# Altium schematic sheet XBee.SchDoc
size A
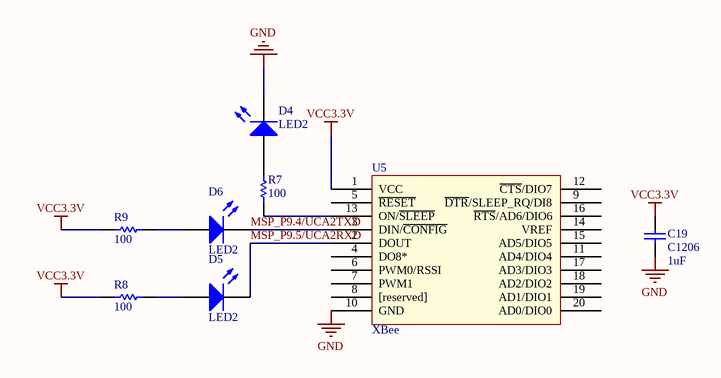
[diagram p0: XBee.SchDoc]

## Parts
C19  C1206  value 1uF  [1206]
D4  LED2  [LED_LiteOn_footprint]
D5  LED2  [LED_LiteOn_footprint]
D6  LED2  [LED_LiteOn_footprint]
R7  100  [8-1206]
R8  100  [8-1206]
R9  100  [8-1206]
U5  XBee  [PCBComponent_1]

## Nets
GND: C19.1 D4.2(K) U5.10(GND)
VCC3.3V: C19.2 R8.1 R9.1 U5.1(VCC)
MSP_P9.4/UCA2TXD: D6.2(K) U5.3(DIN/~{CONFIG})
MSP_P9.5/UCA2RXD: D5.2(K) U5.2(DOUT)
NetD4_1: D4.1(A) R7.1
NetD5_1: D5.1(A) R8.2
NetD6_1: D6.1(A) R9.2
NetR7_2: R7.2 U5.13(ON/~{SLEEP})

Not connected (* = marked no-connect by the designer): U5 4(DO8*) 5(~{RESET}) 6(PWM0/RSSI) 7(PWM1) 8([reserved]) 9(~{DTR}/SLEEP_RQ/DI8) 11(AD4/DIO4) 12(~{CTS}/DIO7) 14(VREF) 15(AD5/DIO5) 16(~{RTS}/AD6/DIO6) 17(AD3/DIO3) 18(AD2/DIO2) 19(AD1/DIO1) 20(AD0/DIO0)

## Library data of the parts
C19 = C1206: Ceramic Chip Capacitor - Standard; Published: 17-Jul-2002; LatestRevisionDate: 19-Mar-2004; LatestRevisionNote: Silkscreen size reduced.; DatasheetDocument: Mar-2001; PackageDocument: Mar-2001; PackageReference: 1206; Publisher: Altium Limited; Code_JEITA: 1206; Code_IPC: 3216 [1206]; ComponentLink1Description: Manufacturer Link; ComponentLink1URL: http://www.kemet.com/; ComponentLink2Description: Datasheet; ComponentLink2URL: http://www.kemet.com/kemet/web/homepage/kechome.nsf/vapubfilesname/F3102TA.pdf/$file/F3102TA.pdf
D4-D6 = LED2: Typical RED, GREEN, YELLOW, AMBER GaAs LED
R7-R9 = ERJ8GE: Thick Film Chip Resistor, 1 Ohm to 10M Ohm Range, 5% Tolerance, 1206 Size, 0.25 W; Note: If flow soldering, adjust pad width of PCB Footprint to 0.7 - 0.8 times the width of the resistor.; Published: 17-Dec-2003; LatestRevisionDate: 19-Mar-2004; LatestRevisionNote: Silkscreen size reduced.; PackageDocument: Mar-2003; PackageReference: 8-1206; Publisher: Altium Limited; Code_IPC: 3216 [1206]; ComponentLink1Description: Manufacturer Link; ComponentLink1URL: http://www.panasonic.com/industrial/components/resistive_products.htm; ComponentLink2Description: Datasheet; ComponentLink2URL: http://www.panasonic.com/industrial/components/pdf/AOA0000CE1.pdf